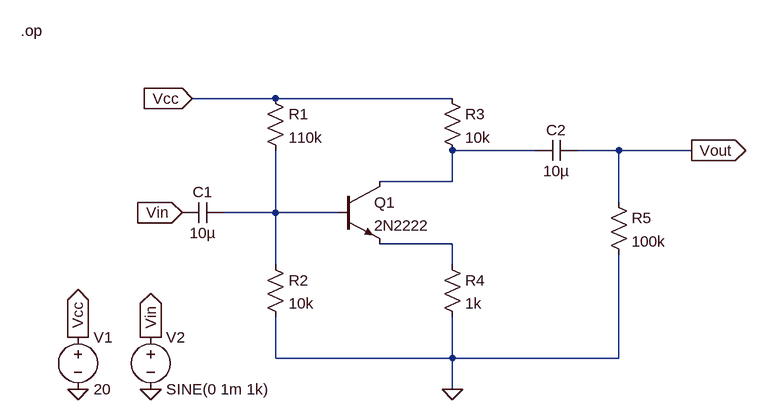
[diagram p0: schematic op1.asc]
op1.asc, the LTspice schematic file:
Version 4
SHEET 1 880 680
WIRE 64 128 -64 128
WIRE 336 128 64 128
WIRE 464 208 336 208
WIRE 592 208 528 208
WIRE 704 208 592 208
WIRE 336 256 336 208
WIRE 336 256 224 256
WIRE 592 288 592 208
WIRE 64 304 64 208
WIRE 64 304 -16 304
WIRE 160 304 64 304
WIRE 336 352 224 352
WIRE 64 384 64 304
WIRE 336 384 336 352
WIRE 64 528 64 464
WIRE 336 528 336 464
WIRE 336 528 64 528
WIRE 592 528 592 368
WIRE 592 528 336 528
WIRE 336 576 336 528
FLAG -240 576 0
FLAG -128 576 0
FLAG -240 496 Vcc
IOPIN -240 496 Out
FLAG -128 496 Vin
IOPIN -128 496 Out
FLAG -64 128 Vcc
IOPIN -64 128 In
FLAG -80 304 Vin
IOPIN -80 304 In
FLAG 336 576 0
FLAG 704 208 Vout
IOPIN 704 208 Out
SYMBOL res 48 112 R0
SYMATTR InstName R1
SYMATTR Value 110k
SYMBOL res 48 368 R0
SYMATTR InstName R2
SYMATTR Value 10k
SYMBOL res 320 112 R0
SYMATTR InstName R3
SYMATTR Value 10k
SYMBOL res 320 368 R0
SYMATTR InstName R4
SYMATTR Value 1k
SYMBOL res 576 272 R0
SYMATTR InstName R5
SYMATTR Value 100k
SYMBOL voltage -240 480 R0
SYMATTR InstName V1
SYMATTR Value 20
SYMBOL voltage -128 480 R0
SYMATTR InstName V2
SYMATTR Value SINE(0 1m 1k)
SYMBOL cap -16 288 R90
WINDOW 0 0 32 VBottom 2
WINDOW 3 32 32 VTop 2
SYMATTR InstName C1
SYMATTR Value 10µ
SYMBOL cap 528 192 R90
WINDOW 0 0 32 VBottom 2
WINDOW 3 32 32 VTop 2
SYMATTR InstName C2
SYMATTR Value 10µ
SYMBOL npn 160 256 R0
SYMATTR InstName Q1
SYMATTR Value 2N2222
TEXT -328 24 Left 2 !.op

The netlist it stands for:
* op1.asc
R1 Vcc N002 110k
R2 N002 0 10k
R3 Vcc N001 10k
R4 N003 0 1k
R5 Vout 0 100k
V1 Vcc 0 20
V2 Vin 0 SINE(0 1m 1k)
C1 N002 Vin 10µ
C2 Vout N001 10µ
Q1 N001 N002 N003 0 2N2222
.model NPN NPN
.model PNP PNP
.lib standard.bjt
.op
.backanno
.end